# EAGLE design NanoLoRaBreakout_2019-05-14 (EAGLE 9.2.0)
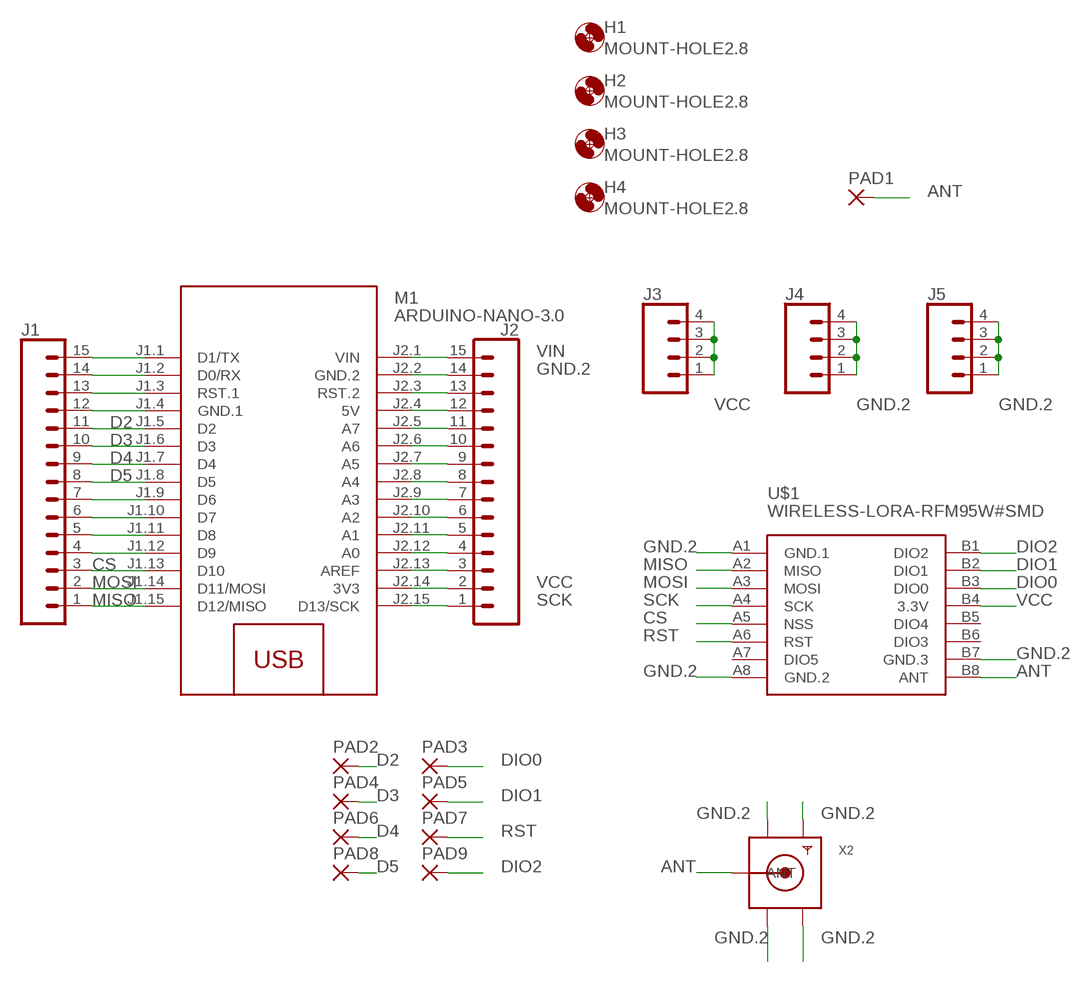
[diagram p0: schematic, sheet 1]

## Parts
H1  MOUNT-HOLE2.8  [2,8]
H2  MOUNT-HOLE2.8  [2,8]
H3  MOUNT-HOLE2.8  [2,8]
H4  MOUNT-HOLE2.8  [2,8]
J1  CONN_15  [1X15]
J2  CONN_15  [1X15]
J3  CONN_04  [1X04]
J4  CONN_04  [1X04]
J5  CONN_04  [1X04]
M1  ARDUINO-NANO-3.0  [ARDUINO-NANO-3.0]
PAD1  1,6/0,8  [1,6/0,8]
PAD2  SMD2  [SMD1,27-2,54]
PAD3  SMD2  [SMD1,27-2,54]
PAD4  SMD2  [SMD1,27-2,54]
PAD5  SMD2  [SMD1,27-2,54]
PAD6  SMD2  [SMD1,27-2,54]
PAD7  SMD2  [SMD1,27-2,54]
PAD8  SMD2  [SMD1,27-2,54]
PAD9  SMD2  [SMD1,27-2,54]
U$1  WIRELESS-LORA-RFM95W#SMD  [WIRELESS-LORA-RFM95W#SMD]
X2  SMACONNECTOR_EDGE_UFL  [SMA_EDGELAUNCH_UFL]

## Nets
ANT [antenna]: PAD1.1(P) U$1.B8(ANT) X2.P(ANT)
CS: J1.3 M1.J1.13(D10) U$1.A5(NSS)
D2: J1.11 M1.J1.5(D2) PAD2.1(P)
D3: J1.10 M1.J1.6(D3) PAD4.1(P)
D4: J1.9 M1.J1.7(D4) PAD6.1(P)
D5: J1.8 M1.J1.8(D5) PAD8.1(P)
DIO0: PAD3.1(P) U$1.B3(DIO0)
DIO1: PAD5.1(P) U$1.B2(DIO1)
DIO2: PAD9.1(P) U$1.B1(DIO2)
GND.2: J2.14 J4.1 J4.2 J4.3 J4.4 J5.1 J5.2 J5.3 J5.4 M1.J2.2(GND.2) U$1.A1(GND.1) U$1.A8(GND.2) U$1.B7(GND.3) X2.GND@1(GND1) X2.GND@2(GND2) X2.GND@3(GND3) X2.GND@4(GND4)
MISO: J1.1 M1.J1.15(D12/MISO) U$1.A2(MISO)
MOSI: J1.2 M1.J1.14(D11/MOSI) U$1.A3(MOSI)
N$19: J1.4 M1.J1.12(D9)
N$20: J1.5 M1.J1.11(D8)
N$21: J1.6 M1.J1.10(D7)
N$22: J1.7 M1.J1.9(D6)
N$27: J1.12 M1.J1.4(GND.1)
N$28: J1.13 M1.J1.3(RST.1)
N$29: J1.14 M1.J1.2(D0/RX)
N$30: J1.15 M1.J1.1(D1/TX)
N$48: J2.3 M1.J2.13(AREF)
N$49: J2.4 M1.J2.12(A0)
N$50: J2.5 M1.J2.11(A1)
N$51: J2.6 M1.J2.10(A2)
N$52: J2.7 M1.J2.9(A3)
N$53: J2.8 M1.J2.8(A4)
N$54: J2.9 M1.J2.7(A5)
N$55: J2.10 M1.J2.6(A6)
N$56: J2.11 M1.J2.5(A7)
N$57: J2.12 M1.J2.4(5V)
N$58: J2.13 M1.J2.3(RST.2)
RST: PAD7.1(P) U$1.A6(RST)
SCK: J2.1 M1.J2.15(D13/SCK) U$1.A4(SCK)
VCC [power]: J2.2 J3.1 J3.2 J3.3 J3.4 M1.J2.14(3V3) U$1.B4(3.3V)
VIN [power]: J2.15 M1.J2.1(VIN)
Unconnected: U$1.A7(DIO5) U$1.B5(DIO4) U$1.B6(DIO3)

## Library data of the parts
H1-H4 = holes:MOUNT-HOLE: MOUNTING HOLE with drill center marker
J1 J2 = SparkFun-Connectors:CONN_15: Multi connection point. Often used as Generic Header-pin footprint for 0.1 inch spaced/style header connections On any of the 0.1 inch spaced packages, you can populate with these: Break Away Headers - Straight <https://www.sparkfun.com/products/116> (PRT-00116) Break Away Male Headers - Right Angle <https://www.sparkfun.com/products/553> (PRT-00553) Female Headers <https://www.sparkfun.com/products/115> (PRT-00115) Break Away Headers - Machine Pin <https://www.sparkfun.com/products/117> (PRT-00117) Break Away Female Headers - Swiss Machine Pin <https://www.sparkfun.com/products/743> (PRT-00743) For SCREWTERMINALS and SPRING TERMINALS visit here: Screw Terimnals on SparkFun.com <https://www.sparkfun.com/search/results?term=Screw+Terminals> (5mm/3.5mm/2.54mm spacing) This device is also useful as a general connection point to wire up your design to another part of your project. Our various solder wires solder well into these plated through hole pads. Hook-Up Wire - Assortment (Stranded, 22 AWG) <https://www.sparkfun.com/products/11375> (PRT-11375) Hook-Up Wire - Assortment (Solid Core, 22 AWG) <https://www.sparkfun.com/products/11367> (PRT-11367) View the entire wire category on our website here <https://www.sparkfun.com/categories/141> Special notes: Molex polarized connector foot print use with SKU : PRT-08231 with associated crimp pins and housings. 1MM SMD Version SKU: PRT-10208 NOTES ON THE VARIANTS LOCK and LOCK_LONGPADS... This footprint was designed to help hold the alignment of a through-hole component (i.e. 6-pin header) while soldering it into place. You may notice that each hole has been shifted either up or down by 0.005 of an inch from it's more standard position (which is a perfectly straight line). This slight alteration caused the pins (the squares in the middle) to touch the edges of the holes. Because they are alternating, it causes a "brace" to hold the component in place. 0.005 has proven to be the perfect amount of "off-center" position when using our standard breakaway headers. Although looks a little odd when you look at the bare footprint, once you have a header in there, the alteration is very hard to notice. Also,if you push a header all the way into place, it is covered up entirely on the bottom side.
J3-J5 = SparkFun-Connectors:CONN_04: Multi connection point. Often used as Generic Header-pin footprint for 0.1 inch spaced/style header connections On any of the 0.1 inch spaced packages, you can populate with these: Break Away Headers - Straight <https://www.sparkfun.com/products/116> (PRT-00116) Break Away Male Headers - Right Angle <https://www.sparkfun.com/products/553> (PRT-00553) Female Headers <https://www.sparkfun.com/products/115> (PRT-00115) Break Away Headers - Machine Pin <https://www.sparkfun.com/products/117> (PRT-00117) Break Away Female Headers - Swiss Machine Pin <https://www.sparkfun.com/products/743> (PRT-00743) For SCREWTERMINALS and SPRING TERMINALS visit here: Screw Terimnals on SparkFun.com <https://www.sparkfun.com/search/results?term=Screw+Terminals> (5mm/3.5mm/2.54mm spacing) This device is also useful as a general connection point to wire up your design to another part of your project. Our various solder wires solder well into these plated through hole pads. Hook-Up Wire - Assortment (Stranded, 22 AWG) <https://www.sparkfun.com/products/11375> (PRT-11375) Hook-Up Wire - Assortment (Solid Core, 22 AWG) <https://www.sparkfun.com/products/11367> (PRT-11367) View the entire wire category on our website here <https://www.sparkfun.com/categories/141> Special notes: Molex polarized connector foot print use with SKU : PRT-08231 with associated crimp pins and housings. 1MM SMD Version SKU: PRT-10208; PROD_ID: CONN-09696
M1 = diy-modules:ARDUINO-NANO-3.0: Arduino Nano 3.0 and compatible devices More details available here: https://www.arduino.cc/en/Main/ArduinoBoardNano Click here to find device on ebay.com <http://www.ebay.com/sch/arduino+nano>
PAD1 = wirepad:1,6/0,8: THROUGH-HOLE PAD
PAD2-PAD9 = wirepad:SMD2: SMD PAD
U$1 = diy-modules:WIRELESS-LORA-RFM95W: 868/915 MHz LoRa Radio Transceiver Module based on SX1276 chip Click here to find device on ebay.com <http://www.ebay.com/sch/RFM95W+transceiver>
X2 = adafruit:SMACONNECTOR: SMA Connector 90° DIP SMA Connector, 50 Ohm (4UConnector: 07259)

## Net classes
0 default: width 0.305 mm
1 power: width 0.508 mm
2 antenna: width 0.508 mm

## Board
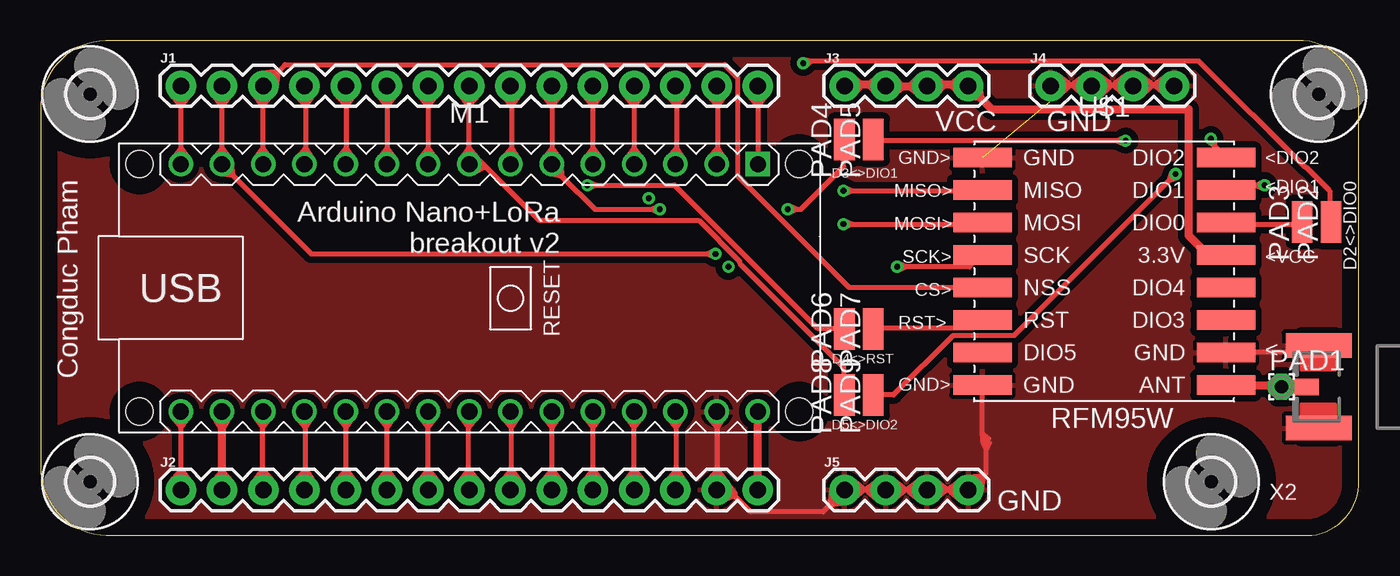
[diagram p1: board, top side]
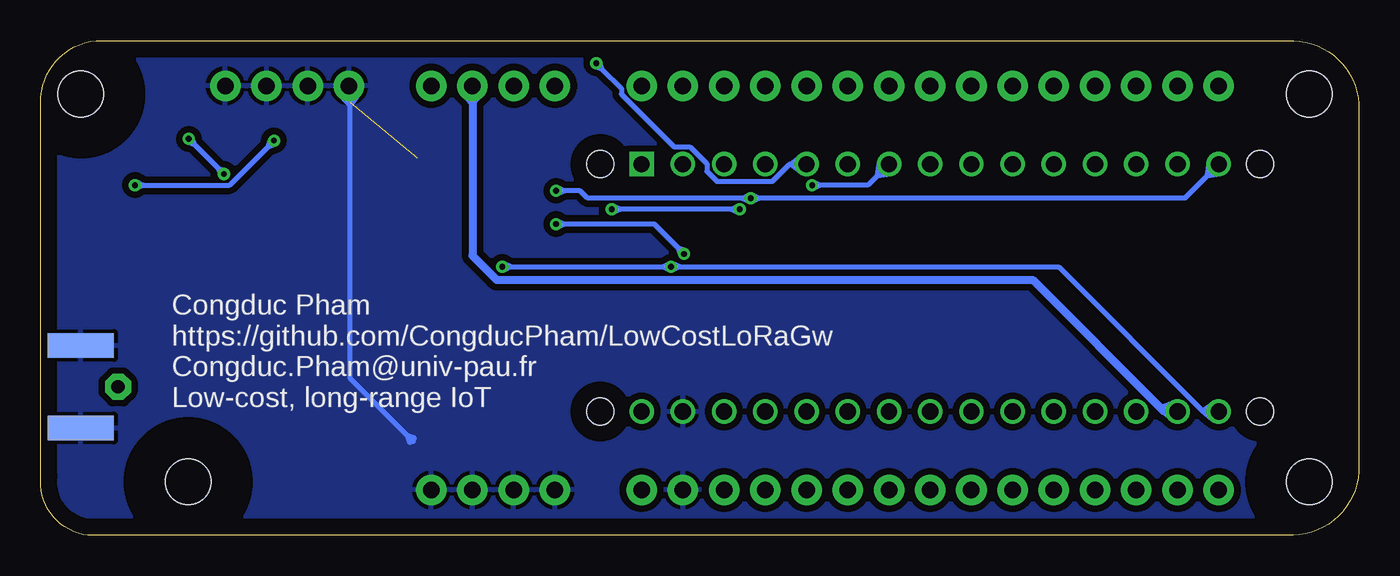
[diagram p2: board, bottom side, seen from below]

Size 81.23 x 30.47 mm. Coordinates in mm from the lower left corner, seen from the top.
Outline: 0,26.19 0,4.3 arc90 4.05,0 78.31,0 arc90 81.2,3.66 81.2,26.31 arc90 77.8,30.47 4.03,30.47 arc90 0,26.19
Copper layers (1*16): Top 0.035mm / dielectric 1.5mm / Bottom 0.035mm
Design rules "default": minimum track width 6mil, minimum drill 0.35mm, track to track 6mil, track to pad 6mil, pad to pad 6mil, via to via 6mil, smd to smd 6mil, copper to edge 40mil, drill to drill 6mil, minimum pad ring 10mil, minimum via ring 8mil, stop-mask expansion 4mil, vias tented up to drill 0mil, thermal gap 10mil

### Footprints (pad centres in the part's own frame; a part is rotated, then mirrored left to right if it is on the bottom)
2,8 = hole 2.8: 0,0
1X15 = drill 1.016 pad 1.88: 1 0,0; 2 2.54,0; 3 5.08,0; 4 7.62,0; 5 10.16,0; 6 12.7,0; 7 15.24,0; 8 17.78,0; 9 20.32,0; 10 22.86,0; 11 25.4,0; 12 27.94,0; 13 30.48,0; 14 33.02,0; 15 35.56,0
1X04 = drill 1.016 pad 1.88: 1 0,0; 2 2.54,0; 3 5.08,0; 4 7.62,0
ARDUINO-NANO-3.0 = drill 1 square: J1.1 17.78,7.62 | drill 1: J1.2 15.24,7.62; J1.3 12.7,7.62; J1.4 10.16,7.62; J1.5 7.62,7.62; J1.6 5.08,7.62; J1.7 2.54,7.62; J1.8 0,7.62; J1.9 -2.54,7.62; J1.10 -5.08,7.62; J1.11 -7.62,7.62; J1.12 -10.16,7.62; J1.13 -12.7,7.62; J1.14 -15.24,7.62; J1.15 -17.78,7.62; J2.1 17.78,-7.62; J2.2 15.24,-7.62; J2.3 12.7,-7.62; J2.4 10.16,-7.62; J2.5 7.62,-7.62; J2.6 5.08,-7.62; J2.7 2.54,-7.62; J2.8 0,-7.62; J2.9 -2.54,-7.62; J2.10 -5.08,-7.62; J2.11 -7.62,-7.62; J2.12 -10.16,-7.62; J2.13 -12.7,-7.62; J2.14 -15.24,-7.62; J2.15 -17.78,-7.62 | hole 1.651: -20.32,7.62; -20.32,-7.62; 20.32,-7.62; 20.32,7.62
1,6/0,8 = drill 0.813 pad 1.6 octagon: 1 0,0
SMD1,27-2,54 = smd 1.27 x 2.54: 1 0,0
WIRELESS-LORA-RFM95W#SMD = smd 3.6 x 1.2: A1 -7.5,7; A2 -7.5,5; A3 -7.5,3; A4 -7.5,1; A5 -7.5,-1; A6 -7.5,-3; A7 -7.5,-5; A8 -7.5,-7; B1 7.5,7; B2 7.5,5; B3 7.5,3; B4 7.5,1; B5 7.5,-1; B6 7.5,-3; B7 7.5,-5; B8 7.5,-7
SMA_EDGELAUNCH_UFL = smd 4.064 x 1.524: GND@1 2.032,-2.54; GND@2 2.032,2.54 | smd 4.064 x 1.524 bottom: GND@3 2.032,2.54; GND@4 2.032,-2.54 | smd 2.032 x 1.016: P 3.048,0

### Placement (x,y rotation side)
H1  3.05,3.3 0 top
H2  78.74,27.18 0 top
H3  72.14,3.3 0 top
H4  3.05,27.18 0 top
J1  8.64,27.69 0 top
J2  8.64,2.79 0 top
J3  49.53,27.69 0 top
J4  62.23,27.69 0 top
J5  49.53,2.79 0 top
M1  26.42,15.24 0 top
PAD1  76.45,9.14 0 top
PAD2  79.5,19.3 0 top
PAD3  77.72,19.3 0 top
PAD4  49.53,24.38 0 top
PAD5  51.31,24.38 0 top
PAD6  49.53,12.7 0 top
PAD7  51.31,12.7 0 top
PAD8  49.53,8.64 0 top
PAD9  51.31,8.64 0 top
U$1  65.53,16.26 0 top
X2  80.77,9.14 180 top

### Tracks (layer width: path | path; a pad name or v marks a point on that pad's centre or on a via)
ANT
  Top 0.508: 77.27,9.11 77.81,9.11 77.81,9.22 X2.P | 77.27,9.11 76.56,9.11 PAD1.1 | 75.64,9.22 76.21,9.22 PAD1.1 | 75.64,9.22 73.13,9.22 U$1.B8 | 77.27,9.11 76.84,9.53 PAD1.1 | 77.27,9.11 76.8,8.72 PAD1.1 | 75.64,9.22 76.05,8.78 PAD1.1 | 75.64,9.22 76.13,9.58 PAD1.1
CS
  Top 0.305: 13.69,23.86 13.69,26.67 13.69,27.62 J1.3 13.8,27.74 14.45,28.39 15.06,28.99 42.15,28.99 42.95,28.19 42.95,22.14 49.81,15.28 57.93,15.28 U$1.A5 | 13.69,23.86 13.69,22.94 M1.J1.13 | 13.69,23.86 13.23,23.21 M1.J1.13 | 13.69,23.86 14.19,23.23 M1.J1.13
  Top 0.61: J1.3 14.2,27.28 13.69,26.67 13.21,27.3 J1.3 | J1.3 13.66,28.32 14.45,28.39 14.35,27.6 J1.3
D2  (via drill 0.35)
  Top 0.305: M1.J1.5 34.04,23.86 | 34.04,23.86 | 34.04,23.86 34.04,26.67 J1.11 | 47.5,29.21 71.37,29.21 77.93,22.66 77.98,22.66 79.43,21.21 79.43,19.38 PAD2.1 | 47.5,29.21 46.99,29.21 v46.99,29.08 | 47.5,29.21 47.03,29.3 v46.99,29.08 | 47.5,29.21 47.14,28.9 v46.99,29.08 | 34.04,23.86 | 34.04,23.86 33.55,23.22 | 33.55,23.22 | 34.04,23.86 34.52,23.22 | 34.52,23.22 | 34.04,23.86 33.55,23.22 | 33.55,23.22 | M1.J1.5 33.55,23.22 | 34.04,23.86 34.52,23.22 | M1.J1.5 34.52,23.22 | 34.04,23.86 33.55,23.22 | M1.J1.5 33.55,23.22 | 34.04,23.86 34.52,23.22 | M1.J1.5 34.52,23.22
  Top 0.61: 34.04,26.67 34.53,27.29 J1.11 33.54,27.29 34.04,26.67
  Bottom 0.305: v46.99,29.08 46.62,28.7 | 46.62,28.7 45.44,27.53 45.44,27.17 42.19,23.92 41.22,23.92 40.18,22.88 40.18,22.42 39.55,21.8 36.14,21.8 35.08,22.86 35.04,22.86 | 35.04,22.86 | 35.04,22.86 M1.J1.5 | 46.62,28.7 47.07,28.86 v46.99,29.08 | 46.62,28.7 46.78,29.15 v46.99,29.08 | 35.04,22.86 34.4,23.34 | 34.4,23.34 | 35.04,22.86 | 35.04,22.86 34.4,22.38 | 34.4,22.38 | 35.04,22.86 34.4,23.34 | 34.4,23.34 | M1.J1.5 34.4,23.34 | 35.04,22.86 34.4,22.38 | M1.J1.5 34.4,22.38 | 35.04,22.86 34.4,23.34 | M1.J1.5 34.4,23.34 | 35.04,22.86 34.4,22.38 | M1.J1.5 34.4,22.38
D3  (via drill 0.35)
  Top 0.305: 31.52,23.86 31.52,26.67 31.52,27.62 J1.10 | 31.52,23.86 31.52,22.94 M1.J1.6 | v46.04,20.08 46.56,20.08 | 46.56,20.08 46.84,20.08 49.47,22.71 49.47,24.31 PAD4.1 | 37.63,20.08 34.15,20.08 32.14,22.09 | 37.63,20.08 v38.15,20.08 | 32.14,22.09 31.52,22.71 M1.J1.6 | 46.56,20.08 46.14,20.28 v46.04,20.08 | 46.56,20.08 46.14,19.88 v46.04,20.08 | 37.63,20.08 38.05,19.88 v38.15,20.08 | 37.63,20.08 38.05,20.28 v38.15,20.08 | 31.52,23.86 31.02,23.23 M1.J1.6 | 31.52,23.86 31.99,23.21 M1.J1.6 | 32.14,22.09 32.1,22.89 M1.J1.6 | 32.14,22.09 31.36,22.27 M1.J1.6
  Top 0.61: 31.52,26.67 32,27.3 J1.10 31.01,27.28 31.52,26.67
  Bottom 0.305: v38.15,20.08 38.68,20.08 | 38.68,20.08 45.51,20.08 | 45.51,20.08 v46.04,20.08 | 45.51,20.08 45.94,19.88 v46.04,20.08 | 45.51,20.08 45.94,20.28 v46.04,20.08 | 38.68,20.08 38.25,20.28 v38.15,20.08 | 38.68,20.08 38.25,19.88 v38.15,20.08
D4  (via drill 0.35)
  Top 0.305: 29.01,23.86 29.01,26.67 29.01,27.62 J1.9 | 29.01,23.86 29.01,22.94 M1.J1.7 | v33.69,21.56 34.22,21.56 | 34.22,21.56 39.07,21.56 47.87,12.76 49.47,12.76 PAD6.1 | 34.22,21.56 33.79,21.77 v33.69,21.56 | 34.22,21.56 33.79,21.36 v33.69,21.56 | 29.01,23.86 28.49,23.25 M1.J1.7 | 29.01,23.86 29.45,23.2 M1.J1.7
  Top 0.61: 29.01,26.67 29.47,27.31 J1.9 28.48,27.27 29.01,26.67
  Bottom 0.305: 33.17,21.56 30.26,21.56 29.67,22.16 | 33.17,21.56 v33.69,21.56 | 29.67,22.16 29.01,22.82 M1.J1.7 | 33.17,21.56 33.6,21.36 v33.69,21.56 | 33.17,21.56 33.6,21.77 v33.69,21.56 | 29.67,22.16 29.55,22.95 M1.J1.7 | 29.67,22.16 28.88,22.26 M1.J1.7
D5
  Top 0.305: 26.38,23.86 26.38,26.67 26.38,27.62 J1.8 | 26.38,23.86 26.38,22.94 M1.J1.8 | 27.4,22.71 26.95,23.16 M1.J1.8 | 27.4,22.71 30.72,19.39 40.55,19.39 43.07,16.88 43.07,16.76 49.47,10.36 49.47,8.65 PAD8.1 | 26.38,23.86 25.92,23.2 M1.J1.8 | 26.38,23.86 26.88,23.24 M1.J1.8 | 27.4,22.71 26.85,23.28 M1.J1.8 | 27.4,22.71 26.7,22.33 M1.J1.8
  Top 0.61: 26.38,26.67 26.9,27.27 J1.8 25.91,27.31 26.38,26.67
DIO0
  Top 0.305: U$1.B3 73.01,19.16 77.58,19.16 PAD3.1
DIO1  (via drill 0.35)
  Top 0.305: v66.84,24.31 66.31,24.31 | 66.31,24.31 51.41,24.31 PAD5.1 | 74.89,21.56 73.35,21.56 73.13,21.34 U$1.B2 | 74.89,21.56 v75.41,21.56 | 66.31,24.31 66.74,24.1 v66.84,24.31 | 66.31,24.31 66.74,24.51 v66.84,24.31 | 74.89,21.56 75.31,21.36 v75.41,21.56 | 74.89,21.56 75.31,21.77 v75.41,21.56
  Bottom 0.305: 67.21,23.94 69.58,21.56 74.89,21.56 | 67.21,23.94 v66.84,24.31 | v75.41,21.56 74.89,21.56 | 67.21,23.94 67.05,24.38 v66.84,24.31 | 67.21,23.94 66.77,24.09 v66.84,24.31 | 74.89,21.56 75.31,21.36 v75.41,21.56 | 74.89,21.56 75.31,21.77 v75.41,21.56
DIO2  (via drill 0.35)
  Top 0.305: v69.93,22.25 69.55,21.88 | 69.55,21.88 59.98,12.31 56.21,12.31 52.55,8.65 51.41,8.65 PAD9.1 | v72.1,24.42 72.1,24.19 72.34,23.95 | 72.34,23.95 73.01,23.28 U$1.B1 | 69.55,21.88 70,22.04 v69.93,22.25 | 69.55,21.88 69.71,22.33 v69.93,22.25 | 72.34,23.95 72.32,24.43 v72.1,24.42 | 72.34,23.95 71.96,24.24 v72.1,24.42
  Bottom 0.305: v72.1,24.42 71.73,24.05 | 71.73,24.05 70.3,22.62 | 70.3,22.62 v69.93,22.25 | 70.3,22.62 69.85,22.46 v69.93,22.25 | 70.3,22.62 70.14,22.17 v69.93,22.25 | 71.73,24.05 72.17,24.21 v72.1,24.42 | 71.73,24.05 71.88,24.5 v72.1,24.42
GND.2  (1 unrouted)
  Top 0.305: 41.69,6.62 41.69,3.81 41.69,2.82 J2.14 41.81,2.82 42.38,2.82 42.64,2.56 43.75,1.45 48.21,1.45 48.82,2.06 49.47,2.7 J5.1 | 41.69,6.62 41.69,7.62 M1.J2.2 | J5.1 49.58,2.82 50.55,2.82 51.05,2.82 51.98,2.82 J5.2 52.21,2.82 53.09,2.82 53.59,2.82 54.61,2.82 J5.3 54.72,2.82 55.63,2.82 56.13,2.82 57.01,2.82 J5.4 57.24,2.82 57.9,3.48 58.27,3.85 58.27,5.27 | J4.1 62.27,27.74 63.25,27.74 63.76,27.74 64.67,27.74 J4.2 64.9,27.74 65.78,27.74 66.3,27.74 67.3,27.74 J4.3 67.41,27.74 68.32,27.74 68.83,27.74 69.81,27.74 J4.4 | 58.27,5.27 58.27,5.79 | 58.04,6.26 58.04,6.13 58.27,5.91 58.27,5.79 | 58.04,6.26 58.04,9.22 U$1.A8 | 58.27,5.27 58.47,5.69 58.27,5.79 | 58.27,5.27 58.06,5.69 58.27,5.79 | 58.04,6.26 58.04,5.79 58.27,5.79 | 58.04,6.26 58.41,5.97 58.27,5.79 | 73.13,11.28 78.38,11.28 78.73,11.62 X2.GND@1 | 49.7,2.7 J5.1 | 41.69,6.62 42.15,7.28 M1.J2.2 | 41.69,6.62 41.19,7.24 M1.J2.2
  Top 0.61: J2.14 41.18,3.21 41.69,3.81 42.17,3.17 J2.14 | J2.14 42.16,3.18 42.64,2.56 41.93,2.22 J2.14 | J5.4 57.11,3.43 57.9,3.48 57.78,2.7 J5.4 | J5.4 56.74,2.31 56.13,2.82 56.77,3.3 J5.4 | J5.1 49.91,3.3 50.55,2.82 49.94,2.31 J5.1 | J5.1 49.61,2.16 48.82,2.06 48.9,2.85 J5.1 | J4.3 66.89,27.21 66.3,27.74 66.94,28.2 J4.3 | J4.3 67.68,28.2 68.32,27.74 67.73,27.21 J4.3 | J4.2 64.35,27.21 63.76,27.74 64.4,28.2 J4.2 | J4.2 65.14,28.2 65.78,27.74 65.19,27.21 J4.2 | J5.3 54.2,2.31 53.59,2.82 54.23,3.3 J5.3 | J5.3 54.99,3.3 55.63,2.82 55.02,2.31 J5.3 | J5.2 51.66,2.31 51.05,2.82 51.69,3.3 J5.2 | J5.2 52.45,3.3 53.09,2.82 52.48,2.31 J5.2 | 68.83,27.74 69.43,27.21 J4.4 69.48,28.2 68.83,27.74 | 63.25,27.74 62.6,28.2 J4.1 62.65,27.21 63.25,27.74
  Bottom 0.305: 58.27,5.79 58.64,6.16 | 58.64,6.16 62.15,9.68 62.15,26.67 62.15,27.62 J4.1 | 58.64,6.16 58.19,6 58.27,5.79 | 58.64,6.16 58.48,5.72 58.27,5.79
  Bottom 0.61: 62.15,26.67 62.7,27.25 J4.1 61.71,27.33 62.15,26.67
  pour Top (isolate 0.406): 81.03,0.25 0.25,0.25 0.25,30.23 81.03,30.23
  pour Bottom (isolate 0.406): 0,30.23 0,0.25 81.03,0.25 81.03,30.23
MISO  (via drill 0.35)
  Top 0.305: v49.47,21.22 49.99,21.22 | 49.99,21.22 57.93,21.22 U$1.A2 | 8.66,23.86 8.66,22.94 M1.J1.15 | 8.66,23.86 8.66,26.67 8.66,27.62 J1.1 | 49.99,21.22 49.56,21.43 | 49.56,21.43 | v49.47,21.22 49.56,21.43 | 49.99,21.22 49.56,21.02 | v49.47,21.22 49.56,21.02 | 49.99,21.22 49.56,21.43 | v49.47,21.22 49.56,21.43 | 49.99,21.22 49.56,21.02 | v49.47,21.22 49.56,21.02 | 8.66,23.86 8.17,23.23 M1.J1.15 | 8.66,23.86 9.13,23.21 M1.J1.15
  Top 0.61: 8.66,26.67 9.14,27.3 J1.1 8.15,27.28 8.66,26.67
  Bottom 0.305: 36.94,20.76 10.72,20.76 9.34,22.15 | 36.94,20.76 v37.47,20.76 | 9.34,22.15 8.66,22.82 M1.J1.15 | 9.34,22.15 | 48.94,21.22 47.98,21.22 47.52,20.76 37.99,20.76 | 48.94,21.22 v49.47,21.22 | v37.47,20.76 37.99,20.76 | 36.94,20.76 | 36.94,20.76 | 36.94,20.76 37.37,20.97 | 36.94,20.76 37.37,20.56 | 37.37,20.56 | v37.47,20.76 37.37,20.56 | 36.94,20.76 37.37,20.97 | v37.47,20.76 37.37,20.97 | 36.94,20.76 37.37,20.56 | v37.47,20.76 37.37,20.56 | 36.94,20.76 37.37,20.97 | v37.47,20.76 37.37,20.97 | 37.99,20.76 37.56,20.97 | 37.56,20.97 | v37.47,20.76 37.56,20.97 | 37.99,20.76 37.56,20.56 | v37.47,20.76 37.56,20.56 | 37.99,20.76 37.56,20.97 | v37.47,20.76 37.56,20.97 | 37.99,20.76 37.56,20.56 | v37.47,20.76 37.56,20.56 | 48.94,21.22 | 48.94,21.22 | 48.94,21.22 49.37,21.43 | 48.94,21.22 49.37,21.02 | 49.37,21.02 | v49.47,21.22 49.37,21.02 | 48.94,21.22 49.37,21.43 | v49.47,21.22 49.37,21.43 | 48.94,21.22 49.37,21.02 | v49.47,21.22 49.37,21.02 | 48.94,21.22 49.37,21.43 | v49.47,21.22 49.37,21.43 | 9.34,22.15 9.23,22.94 | M1.J1.15 9.23,22.94 | 9.34,22.15 | 9.34,22.15 8.55,22.27 | 8.55,22.27 | 9.34,22.15 9.23,22.94 | M1.J1.15 9.23,22.94 | 9.34,22.15 8.55,22.27 | M1.J1.15 8.55,22.27 | 9.34,22.15 9.23,22.94 | M1.J1.15 9.23,22.94 | 9.34,22.15 8.55,22.27 | M1.J1.15 8.55,22.27
MOSI  (via drill 0.35)
  Top 0.305: 41.05,17.33 16.66,17.33 11.86,22.13 | 41.05,17.33 v41.58,17.33 | 11.86,22.13 11.18,22.82 M1.J1.14 | 11.86,22.13 | v49.47,19.16 49.99,19.16 | 49.99,19.16 57.93,19.16 U$1.A3 | M1.J1.14 11.18,23.86 | 11.18,23.86 | 11.18,23.86 11.18,26.67 J1.2 | 41.05,17.33 | 41.05,17.33 | 41.05,17.33 41.48,17.54 | 41.05,17.33 41.48,17.13 | 41.48,17.13 | v41.58,17.33 41.48,17.13 | 41.05,17.33 41.48,17.54 | v41.58,17.33 41.48,17.54 | 41.05,17.33 41.48,17.13 | v41.58,17.33 41.48,17.13 | 41.05,17.33 41.48,17.54 | v41.58,17.33 41.48,17.54 | 49.99,19.16 49.56,19.37 | 49.56,19.37 | v49.47,19.16 49.56,19.37 | 49.99,19.16 49.56,18.96 | v49.47,19.16 49.56,18.96 | 49.99,19.16 49.56,19.37 | v49.47,19.16 49.56,19.37 | 49.99,19.16 49.56,18.96 | v49.47,19.16 49.56,18.96 | 11.86,22.13 11.77,22.93 | 11.77,22.93 | 11.86,22.13 | 11.86,22.13 11.08,22.27 | M1.J1.14 11.08,22.27 | 11.18,23.86 | 11.18,23.86 10.7,23.22 | 10.7,23.22 | 11.18,23.86 11.66,23.22 | 11.66,23.22 | 11.86,22.13 11.77,22.93 | 11.77,22.93 | M1.J1.14 11.77,22.93 | 11.86,22.13 11.08,22.27 | 11.86,22.13 11.77,22.93 | M1.J1.14 11.77,22.93 | 11.86,22.13 11.08,22.27 | M1.J1.14 11.08,22.27 | 11.18,23.86 10.7,23.22 | 10.7,23.22 | M1.J1.14 10.7,23.22 | 11.18,23.86 11.66,23.22 | M1.J1.14 11.66,23.22 | 11.18,23.86 10.7,23.22 | M1.J1.14 10.7,23.22 | 11.18,23.86 11.66,23.22 | M1.J1.14 11.66,23.22
  Top 0.61: 11.18,26.67 11.67,27.29 J1.2 10.68,27.29 11.18,26.67
  Bottom 0.305: 48.94,19.16 43.41,19.16 41.95,17.71 | 48.94,19.16 v49.47,19.16 | v41.58,17.33 41.95,17.71 | 41.95,17.71 41.5,17.55 v41.58,17.33 | 41.95,17.71 41.79,17.26 v41.58,17.33 | 48.94,19.16 | 48.94,19.16 | 48.94,19.16 49.37,19.37 | 48.94,19.16 49.37,18.96 | 49.37,18.96 | v49.47,19.16 49.37,18.96 | 48.94,19.16 49.37,19.37 | v49.47,19.16 49.37,19.37 | 48.94,19.16 49.37,18.96 | v49.47,19.16 49.37,18.96 | 48.94,19.16 49.37,19.37 | v49.47,19.16 49.37,19.37
N$19
  Top 0.305: 16.32,23.86 16.32,26.67 16.32,27.62 J1.4 | 16.32,23.86 16.32,22.94 M1.J1.12 | 16.32,23.86 15.8,23.25 M1.J1.12 | 16.32,23.86 16.76,23.19 M1.J1.12
  Top 0.61: 16.32,26.67 16.78,27.32 J1.4 15.79,27.26 16.32,26.67
N$20
  Top 0.305: 18.83,23.86 18.83,26.67 18.83,27.62 J1.5 | 18.83,23.86 18.83,22.94 M1.J1.11 | 18.83,23.86 18.33,23.24 M1.J1.11 | 18.83,23.86 19.29,23.2 M1.J1.11
  Top 0.61: 18.83,26.67 19.31,27.31 J1.5 18.32,27.27 18.83,26.67
N$21
  Top 0.305: 21.35,23.86 21.35,26.67 21.35,27.62 J1.6 | 21.35,23.86 21.35,22.94 M1.J1.10 | 21.35,23.86 20.86,23.23 M1.J1.10 | 21.35,23.86 21.82,23.22 M1.J1.10
  Top 0.61: 21.35,26.67 21.84,27.3 J1.6 20.84,27.28 21.35,26.67
N$22
  Top 0.305: 23.86,23.86 23.86,26.67 23.86,27.62 J1.7 | 23.86,23.86 23.86,22.94 M1.J1.9 | 23.86,23.86 23.39,23.22 M1.J1.9 | 23.86,23.86 24.35,23.23 M1.J1.9
  Top 0.61: 23.86,26.67 24.37,27.28 J1.7 23.38,27.3 23.86,26.67
N$27
  Top 0.305: 36.55,23.86 36.55,26.67 36.55,27.62 J1.12 | 36.55,23.86 36.55,22.94 M1.J1.4 | 36.55,23.86 36.09,23.21 M1.J1.4 | 36.55,23.86 37.05,23.23 M1.J1.4
  Top 0.61: 36.55,26.67 37.06,27.28 J1.12 36.07,27.3 36.55,26.67
N$28
  Top 0.305: 39.18,23.86 39.18,26.67 39.18,27.62 J1.13 | 39.18,23.86 39.18,22.94 M1.J1.3 | 39.18,23.86 38.66,23.25 M1.J1.3 | 39.18,23.86 39.62,23.19 M1.J1.3
  Top 0.61: 39.18,26.67 39.64,27.32 J1.13 38.65,27.26 39.18,26.67
N$29
  Top 0.305: 41.69,23.86 41.69,26.67 41.69,27.62 J1.14 | 41.69,23.86 41.69,22.94 M1.J1.2 | 41.69,23.86 41.19,23.24 M1.J1.2 | 41.69,23.86 42.15,23.2 M1.J1.2
  Top 0.61: 41.69,26.67 42.17,27.31 J1.14 41.18,27.27 41.69,26.67
N$30
  Top 0.305: M1.J1.1 44.21,22.94 44.21,26.67 44.21,27.62 J1.15
  Top 0.61: 44.21,26.67 44.7,27.3 J1.15 43.71,27.28 44.21,26.67
N$48
  Top 0.305: 13.69,6.62 13.69,3.81 13.69,2.82 J2.3 | 13.69,6.62 13.69,7.62 M1.J2.13 | 13.69,6.62 14.19,7.25 M1.J2.13 | 13.69,6.62 13.23,7.27 M1.J2.13
  Top 0.61: 13.69,3.81 13.21,3.18 J2.3 14.2,3.2 13.69,3.81
N$49
  Top 0.305: 16.32,6.62 16.32,3.81 16.32,2.82 J2.4 | 16.32,6.62 16.32,7.62 M1.J2.12 | 16.32,6.62 16.76,7.29 M1.J2.12 | 16.32,6.62 15.8,7.23 M1.J2.12
  Top 0.61: 16.32,3.81 15.79,3.22 J2.4 16.78,3.16 16.32,3.81
N$50
  Top 0.305: 18.83,6.62 18.83,3.81 18.83,2.82 J2.5 | 18.83,6.62 18.83,7.62 M1.J2.11 | 18.83,6.62 19.29,7.28 M1.J2.11 | 18.83,6.62 18.33,7.24 M1.J2.11
  Top 0.61: 18.83,3.81 18.32,3.21 J2.5 19.31,3.17 18.83,3.81
N$51
  Top 0.305: 21.35,6.62 21.35,3.81 21.35,2.82 J2.6 | 21.35,6.62 21.35,7.62 M1.J2.10 | 21.35,6.62 21.82,7.26 M1.J2.10 | 21.35,6.62 20.86,7.25 M1.J2.10
  Top 0.61: 21.35,3.81 20.84,3.2 J2.6 21.84,3.19 21.35,3.81
N$52
  Top 0.305: 23.86,6.62 23.86,3.81 23.86,2.82 J2.7 | 23.86,6.62 23.86,7.62 M1.J2.9 | 23.86,6.62 24.35,7.25 M1.J2.9 | 23.86,6.62 23.39,7.26 M1.J2.9
  Top 0.61: 23.86,3.81 23.38,3.19 J2.7 24.37,3.2 23.86,3.81
N$53
  Top 0.305: 26.38,6.62 26.38,3.81 26.38,2.82 J2.8 | 26.38,6.62 26.38,7.62 M1.J2.8 | 26.38,6.62 26.88,7.24 M1.J2.8 | 26.38,6.62 25.92,7.28 M1.J2.8
  Top 0.61: 26.38,3.81 25.91,3.17 J2.8 26.9,3.21 26.38,3.81
N$54
  Top 0.305: 29.01,6.62 29.01,3.81 29.01,2.82 J2.9 | 29.01,6.62 29.01,7.62 M1.J2.7 | 29.01,6.62 29.45,7.28 M1.J2.7 | 29.01,6.62 28.49,7.23 M1.J2.7
  Top 0.61: 29.01,3.81 28.48,3.21 J2.9 29.47,3.17 29.01,3.81
N$55
  Top 0.305: 31.52,6.62 31.52,3.81 31.52,2.82 J2.10 | 31.52,6.62 31.52,7.62 M1.J2.6 | 31.52,6.62 31.99,7.27 M1.J2.6 | 31.52,6.62 31.02,7.25 M1.J2.6
  Top 0.61: 31.52,3.81 31.01,3.2 J2.10 32,3.18 31.52,3.81
N$56
  Top 0.305: J2.11 34.04,3.81 34.04,6.62 | 34.04,6.62 | 34.04,6.62 M1.J2.5 | 34.04,6.62 34.52,7.26 | 34.52,7.26 | 34.04,6.62 | 34.04,6.62 33.55,7.26 | 33.55,7.26 | 34.04,6.62 34.52,7.26 | 34.52,7.26 | M1.J2.5 34.52,7.26 | 34.04,6.62 33.55,7.26 | M1.J2.5 33.55,7.26 | 34.04,6.62 34.52,7.26 | M1.J2.5 34.52,7.26 | 34.04,6.62 33.55,7.26 | M1.J2.5 33.55,7.26
  Top 0.61: 34.04,3.81 33.54,3.19 J2.11 34.53,3.19 34.04,3.81
N$57
  Top 0.305: 36.55,6.62 36.55,3.81 36.55,2.82 J2.12 | 36.55,6.62 36.55,7.62 M1.J2.4 | 36.55,6.62 37.05,7.25 M1.J2.4 | 36.55,6.62 36.09,7.27 M1.J2.4
  Top 0.61: 36.55,3.81 36.07,3.18 J2.12 37.06,3.2 36.55,3.81
N$58
  Top 0.305: 39.18,6.62 39.18,3.81 39.18,2.82 J2.13 | 39.18,6.62 39.18,7.62 M1.J2.3 | 39.18,6.62 39.62,7.29 M1.J2.3 | 39.18,6.62 38.66,7.23 M1.J2.3
  Top 0.61: 39.18,3.81 38.65,3.22 J2.13 39.64,3.16 39.18,3.81
RST
  Top 0.305: PAD7.1 51.41,12.76 57.47,12.76 57.93,13.22 U$1.A6
SCK  (via drill 0.35)
  Top 0.305: 8.66,6.62 8.66,3.81 8.66,2.82 J2.1 | 8.66,6.62 8.66,7.62 M1.J2.15 | 53.31,16.53 57.24,16.53 57.93,17.22 U$1.A4 | 53.31,16.53 v52.78,16.53 | 53.31,16.53 52.88,16.74 | 52.88,16.74 | v52.78,16.53 52.88,16.74 | 53.31,16.53 52.88,16.33 | v52.78,16.53 52.88,16.33 | 53.31,16.53 52.88,16.74 | v52.78,16.53 52.88,16.74 | 53.31,16.53 52.88,16.33 | v52.78,16.53 52.88,16.33 | 8.66,6.62 9.13,7.27 M1.J2.15 | 8.66,6.62 8.17,7.25 M1.J2.15
  Top 0.61: 8.66,3.81 8.15,3.2 J2.1 9.14,3.18 8.66,3.81
  Bottom 0.305: v52.78,16.53 52.26,16.53 | 52.26,16.53 42.91,16.53 | 42.91,16.53 v42.38,16.53 | M1.J2.15 9.58,7.62 9.63,7.68 | 9.63,7.68 18.49,16.53 41.86,16.53 | v42.38,16.53 41.86,16.53 | 41.86,16.53 | 41.86,16.53 | 41.86,16.53 42.28,16.74 | 42.91,16.53 42.48,16.74 | 42.48,16.74 | v42.38,16.53 42.48,16.74 | 42.91,16.53 42.48,16.33 | v42.38,16.53 42.48,16.33 | 42.91,16.53 42.48,16.74 | v42.38,16.53 42.48,16.74 | 42.91,16.53 42.48,16.33 | v42.38,16.53 42.48,16.33 | 41.86,16.53 42.28,16.33 | 42.28,16.33 | v42.38,16.53 42.28,16.33 | 41.86,16.53 42.28,16.74 | v42.38,16.53 42.28,16.74 | 41.86,16.53 42.28,16.33 | v42.38,16.53 42.28,16.33 | 41.86,16.53 42.28,16.74 | v42.38,16.53 42.28,16.74 | 52.26,16.53 | 52.26,16.53 | 52.26,16.53 52.68,16.74 | 52.26,16.53 52.68,16.33 | 52.68,16.33 | v52.78,16.53 52.68,16.33 | 52.26,16.53 52.68,16.74 | v52.78,16.53 52.68,16.74 | 52.26,16.53 52.68,16.33 | v52.78,16.53 52.68,16.33 | 52.26,16.53 52.68,16.74 | v52.78,16.53 52.68,16.74 | 9.63,7.68 8.97,8.12 M1.J2.15 | 9.63,7.68 9.03,7.16 M1.J2.15
VCC
  Top 0.508: J2.2 11.18,3.81 | 11.18,3.81 11.18,6.62 | 11.18,6.62 M1.J2.14 | 51.05,27.74 51.98,27.74 J3.2 | 51.05,27.74 50.55,27.74 | 50.55,27.74 49.58,27.74 J3.1 | 57.88,26.98 57.24,27.62 J3.4 | 57.88,26.98 58.61,26.25 70.73,26.25 70.73,18.48 71.98,17.22 72.78,17.22 U$1.B4 | 56.14,27.74 56.9,27.74 J3.4 | 56.14,27.74 55.62,27.74 | 55.62,27.74 54.61,27.74 J3.3 | 53.6,27.62 54.38,27.62 J3.3 | 53.6,27.62 53.08,27.62 | 53.08,27.62 52.32,27.62 J3.2 | 11.18,6.62 11.61,7.37 M1.J2.14 | 11.18,6.62 10.74,7.37 M1.J2.14 | 11.18,3.81 10.67,3.26 J2.2 | 11.18,3.81 11.68,3.26 J2.2 | 57.88,26.98 57.83,27.73 J3.4 | 57.88,26.98 57.13,27 J3.4 | 56.14,27.74 56.66,27.2 J3.4 | 56.14,27.74 56.71,28.22 J3.4 | 50.55,27.74 49.97,28.22 J3.1 | 50.55,27.74 50.02,27.2 J3.1 | 55.62,27.74 55.05,28.22 J3.3 | 55.62,27.74 55.1,27.2 J3.3 | 53.6,27.62 54.18,27.15 J3.3 | 53.6,27.62 54.12,28.16 J3.3 | 51.05,27.74 51.58,27.2 J3.2 | 51.05,27.74 51.63,28.22 J3.2 | 53.08,27.62 52.56,28.16 J3.2 | 53.08,27.62 52.5,27.15 J3.2
  Bottom 0.508: M1.J2.14 11.98,7.62 12.16,7.8 | 12.16,7.8 20.09,15.73 53.12,15.73 54.61,17.22 54.61,26.67 | J3.3 54.61,26.67 | 12.16,7.8 11.34,8.09 M1.J2.14 | 12.16,7.8 11.5,7.24 M1.J2.14 | 54.61,26.67 55.12,27.22 J3.3 | 54.61,26.67 54.1,27.22 J3.3
VIN
  Top 0.508: M1.J2.1 44.21,7.62 44.21,2.82 J2.15

### Text on the board
tPlace: VCC | GND | D3<>DIO1 | GND> | <DIO2 | <DIO1 | D2<>DIO0 | Arduino Nano+LoRa / breakout v2 | MISO> | MOSI> | SCK> | <VCC | CS> | RST> | D4<>RST | < | Congduc Pham | GND> | D5<>DIO2 | RFM95W | GND
bPlace: Congduc Pham / https://github.com/CongducPham/LowCostLoRaGw / Congduc.Pham@univ-pau.fr / Low-cost, long-range IoT